# Altium schematic sheet main.SchDoc
size A4
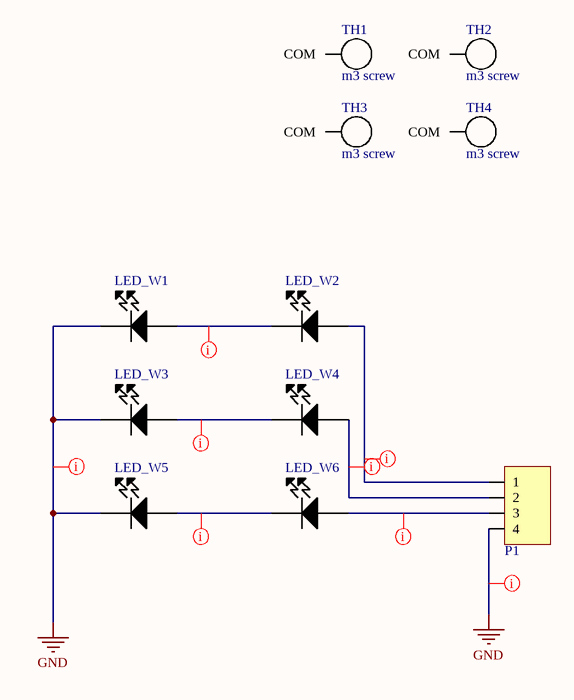
[diagram p0: main.SchDoc]

## Parts
LED_W1  MP-3030-210H-40-95  [MP-3030-210H-40-95]  (value not drawn)
LED_W2  MP-3030-210H-40-95  [MP-3030-210H-40-95]  (value not drawn)
LED_W3  MP-3030-210H-40-95  [MP-3030-210H-40-95]  (value not drawn)
LED_W4  MP-3030-210H-40-95  [MP-3030-210H-40-95]  (value not drawn)
LED_W5  MP-3030-210H-40-95  [MP-3030-210H-40-95]  (value not drawn)
LED_W6  MP-3030-210H-40-95  [MP-3030-210H-40-95]  (value not drawn)
P1  Mini-Fit Jr 4 Pos  [MOLEX 0039281043]  (value not drawn)
TH1  m3 screw  [m3screw]
TH2  m3 screw  [m3screw]
TH3  m3 screw  [m3screw]
TH4  m3 screw  [m3screw]

## Nets
GND: LED_W1.1(-) LED_W3.1(-) LED_W5.1(-) P1.4
NetLED_W1_2: LED_W1.2(+) LED_W2.1(-)
NetLED_W2_2: LED_W2.2(+) P1.1
NetLED_W3_2: LED_W3.2(+) LED_W4.1(-)
NetLED_W4_2: LED_W4.2(+) P1.2
NetLED_W5_2: LED_W5.2(+) LED_W6.1(-)
NetLED_W6_2: LED_W6.2(+) P1.3

Not connected (* = marked no-connect by the designer): TH1 0(COM); TH2 0(COM); TH3 0(COM); TH4 0(COM)

## Layout directives
rule Width Constraint [Pref Width = 30mil    Min Width = 10mil    Max Width = 60mil]: GND, NetLED_W1_2, NetLED_W2_2, NetLED_W3_2, NetLED_W4_2, NetLED_W5_2, NetLED_W6_2

## Library data of the parts
LED_W1-LED_W6 = MP-3030-210H-40-95: White 4000K neutral 1.5W 95CRI SMT3030 LED 6V 150mA
P1 = Molex 0039281043: Mini-Fit Jr. Header, Dual Row, Right-Angle, with Snap-in Plastic Peg PCB Lock, 6 Circuits, PA Polyamide Nylon 6/6 94V-2, 0.76µm Select Gold (Au) Plating